# Altium schematic sheet VisionBETA.SchDoc
size C; SheetNumber: 1; SheetTotal: 9
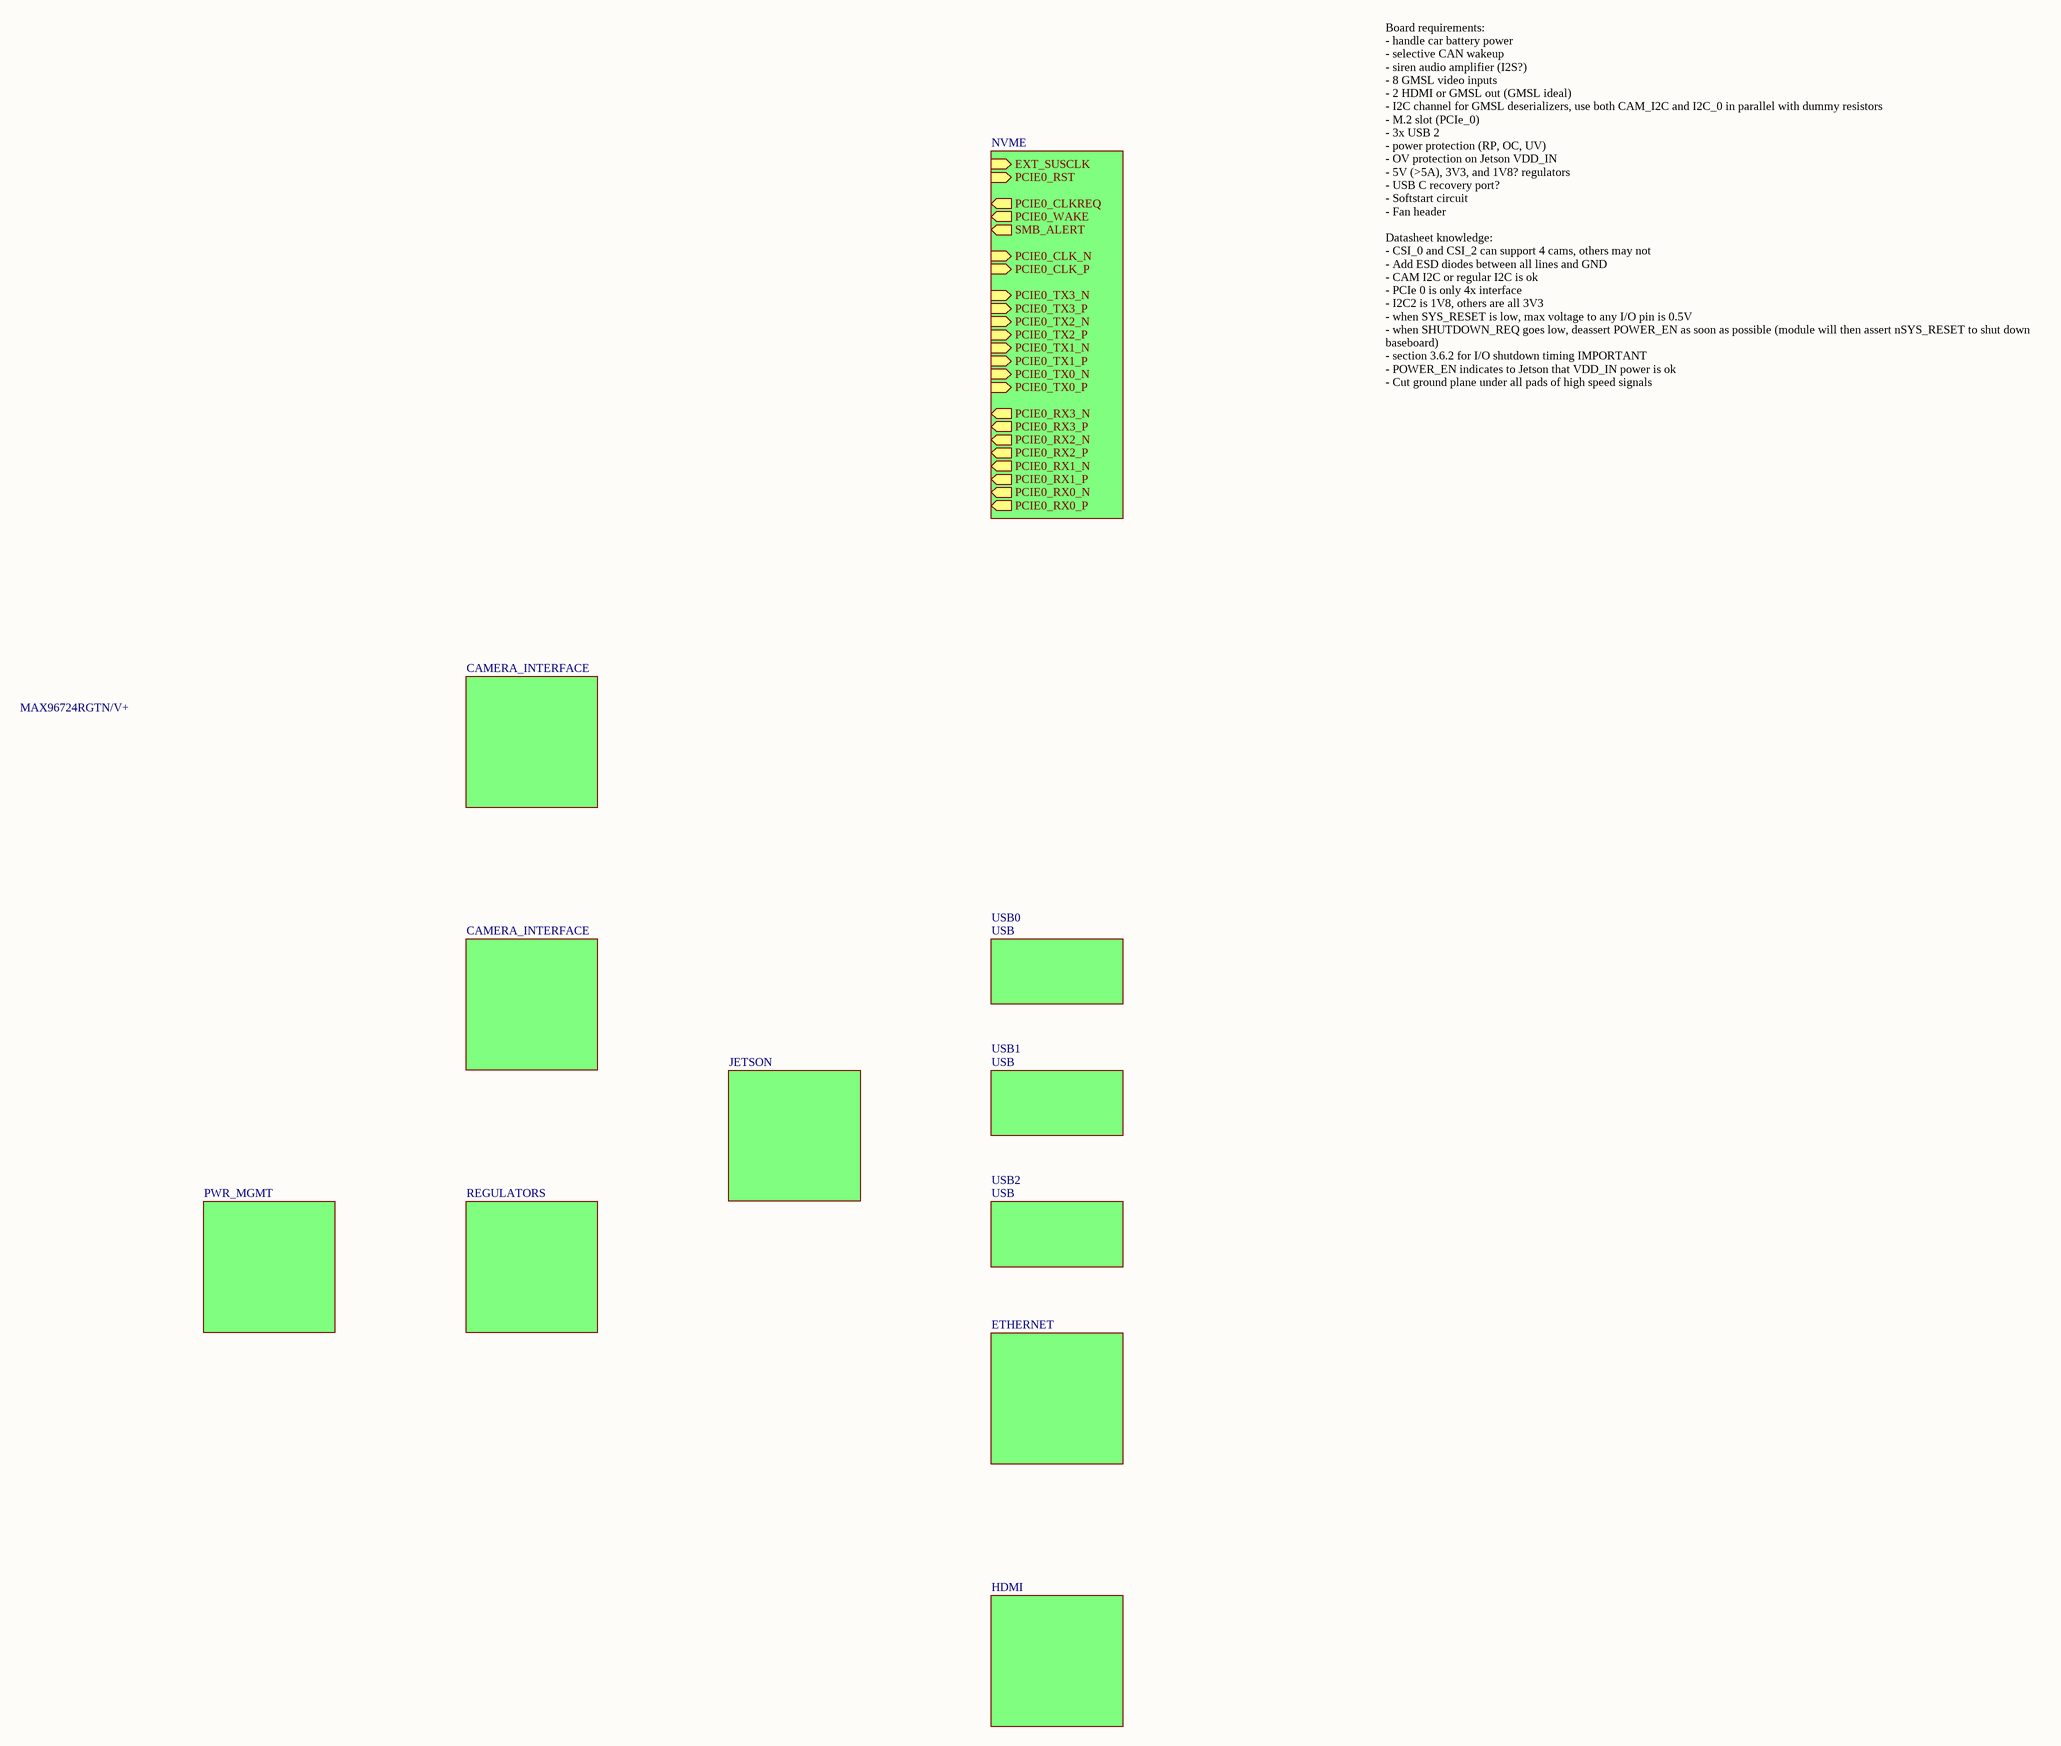
[diagram p0: VisionBETA.SchDoc]

## Sub-sheets
CAMIF_0 = CAMERA_INTERFACE: no entries
CAMIF_1 = CAMERA_INTERFACE: no entries
ETH0 = ETHERNET: no entries
HDMI_0 = HDMI: no entries
JETSON = JETSON: no entries
NVME = NVME: EXT_SUSCLK (in), PCIE0_RST (in), PCIE0_CLKREQ (out), PCIE0_WAKE (out), SMB_ALERT (out), PCIE0_CLK_N (in), PCIE0_CLK_P (in), PCIE0_TX3_N (in), PCIE0_TX3_P (in), PCIE0_TX2_N (in), PCIE0_TX2_P (in), PCIE0_TX1_N (in), PCIE0_TX1_P (in), PCIE0_TX0_N (in), PCIE0_TX0_P (in), PCIE0_RX3_N (out), PCIE0_RX3_P (out), PCIE0_RX2_N (out), PCIE0_RX2_P (out), PCIE0_RX1_N (out), PCIE0_RX1_P (out), PCIE0_RX0_N (out), PCIE0_RX0_P (out)
PWR_MGMT = PWR_MGMT: no entries
REGULATORS = REGULATORS: no entries
USB0 = USB: no entries
USB1 = USB: no entries
USB2 = USB: no entries

## Notes on the sheet
- MAX96724RGTN/V+
- Board requirements:
  - handle car battery power
  - selective CAN wakeup
  - siren audio amplifier (I2S?)
  - 8 GMSL video inputs
  - 2 HDMI or GMSL out (GMSL ideal)
  - I2C channel for GMSL deserializers, use both CAM_I2C and I2C_0 in parallel with dummy resistors
  - M.2 slot (PCIe_0)
  - 3x USB 2
  - power protection (RP, OC, UV)
  - OV protection on Jetson VDD_IN
  - 5V (>5A), 3V3, and 1V8? regulators
  - USB C recovery port?
  - Softstart circuit
  - Fan header
  Datasheet knowledge:
  - CSI_0 and CSI_2 can support 4 cams, others may not
  - Add ESD diodes between all lines and GND
  - CAM I2C or regular I2C is ok
  - PCIe 0 is only 4x interface
  - I2C2 is 1V8, others are all 3V3
  - when SYS_RESET is low, max voltage to any I/O pin is 0.5V
  - when SHUTDOWN_REQ goes low, deassert POWER_EN as soon as possible (module will then assert nSYS_RESET to shut down baseboard)
  - section 3.6.2 for I/O shutdown timing IMPORTANT
  - POWER_EN indicates to Jetson that VDD_IN power is ok
  - Cut ground plane under all pads of high speed signals